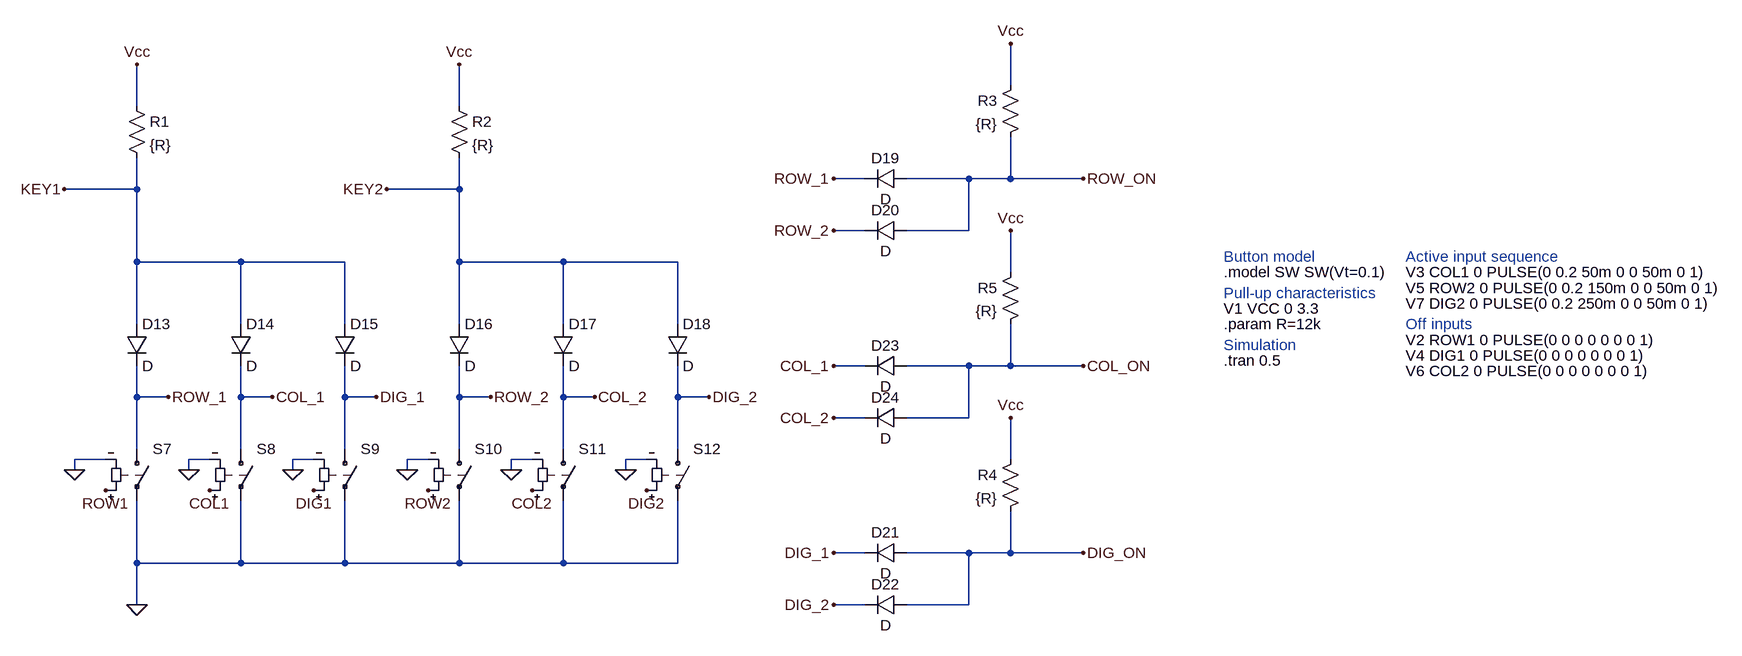
[diagram p0: schematic keyboard.asc]
keyboard.asc, the LTspice schematic file:
Version 4
SHEET 1 4832 1104
WIRE 3712 -48 3712 -112
WIRE 2368 -16 2368 -80
WIRE 2864 -16 2864 -80
WIRE 3488 96 3440 96
WIRE 3648 96 3552 96
WIRE 3712 96 3712 32
WIRE 3712 96 3648 96
WIRE 3824 96 3712 96
WIRE 2368 112 2368 64
WIRE 2368 112 2256 112
WIRE 2864 112 2864 64
WIRE 2864 112 2752 112
WIRE 3488 176 3440 176
WIRE 3648 176 3648 96
WIRE 3648 176 3552 176
WIRE 2368 224 2368 112
WIRE 2528 224 2368 224
WIRE 2688 224 2528 224
WIRE 2864 224 2864 112
WIRE 3024 224 2864 224
WIRE 3200 224 3024 224
WIRE 3712 240 3712 176
WIRE 2368 320 2368 224
WIRE 2528 320 2528 224
WIRE 2688 320 2688 224
WIRE 2864 320 2864 224
WIRE 3024 320 3024 224
WIRE 3200 320 3200 224
WIRE 3488 384 3440 384
WIRE 3648 384 3552 384
WIRE 3712 384 3712 320
WIRE 3712 384 3648 384
WIRE 3824 384 3712 384
WIRE 2368 432 2368 384
WIRE 2416 432 2368 432
WIRE 2528 432 2528 384
WIRE 2576 432 2528 432
WIRE 2688 432 2688 384
WIRE 2736 432 2688 432
WIRE 2864 432 2864 384
WIRE 2912 432 2864 432
WIRE 3024 432 3024 384
WIRE 3072 432 3024 432
WIRE 3200 432 3200 384
WIRE 3248 432 3200 432
WIRE 3488 464 3440 464
WIRE 3648 464 3648 384
WIRE 3648 464 3552 464
WIRE 2368 512 2368 432
WIRE 2528 512 2528 432
WIRE 2688 512 2688 432
WIRE 2864 512 2864 432
WIRE 3024 512 3024 432
WIRE 3200 512 3200 432
WIRE 2320 528 2272 528
WIRE 2480 528 2448 528
WIRE 2640 528 2608 528
WIRE 2816 528 2784 528
WIRE 2976 528 2944 528
WIRE 3152 528 3120 528
WIRE 3712 528 3712 464
WIRE 2272 544 2272 528
WIRE 2448 544 2448 528
WIRE 2608 544 2608 528
WIRE 2784 544 2784 528
WIRE 2944 544 2944 528
WIRE 3120 544 3120 528
WIRE 3488 672 3440 672
WIRE 3648 672 3552 672
WIRE 3712 672 3712 608
WIRE 3712 672 3648 672
WIRE 3824 672 3712 672
WIRE 2368 688 2368 592
WIRE 2528 688 2528 592
WIRE 2528 688 2368 688
WIRE 2688 688 2688 592
WIRE 2688 688 2528 688
WIRE 2864 688 2864 592
WIRE 2864 688 2688 688
WIRE 3024 688 3024 592
WIRE 3024 688 2864 688
WIRE 3200 688 3200 592
WIRE 3200 688 3024 688
WIRE 2368 752 2368 688
WIRE 3488 752 3440 752
WIRE 3648 752 3648 672
WIRE 3648 752 3552 752
FLAG 2368 -80 Vcc
FLAG 2256 112 KEY1
FLAG 2320 576 ROW1
FLAG 2480 576 COL1
FLAG 2640 576 DIG1
FLAG 2368 752 0
FLAG 2864 -80 Vcc
FLAG 2752 112 KEY2
FLAG 2816 576 ROW2
FLAG 2976 576 COL2
FLAG 3152 576 DIG2
FLAG 3712 -112 Vcc
FLAG 3824 96 ROW_ON
FLAG 3712 464 Vcc
FLAG 3824 672 DIG_ON
FLAG 3824 384 COL_ON
FLAG 3712 176 Vcc
FLAG 2784 544 0
FLAG 2944 544 0
FLAG 3120 544 0
FLAG 2608 544 0
FLAG 2448 544 0
FLAG 2272 544 0
FLAG 2416 432 ROW_1
FLAG 2576 432 COL_1
FLAG 2736 432 DIG_1
FLAG 2912 432 ROW_2
FLAG 3072 432 COL_2
FLAG 3248 432 DIG_2
FLAG 3440 96 ROW_1
FLAG 3440 176 ROW_2
FLAG 3440 384 COL_1
FLAG 3440 464 COL_2
FLAG 3440 752 DIG_2
FLAG 3440 672 DIG_1
SYMBOL res 2352 -32 R0
SYMATTR InstName R1
SYMATTR Value {R}
SYMBOL diode 2352 320 R0
SYMATTR InstName D13
SYMBOL diode 2512 320 R0
SYMATTR InstName D14
SYMBOL diode 2672 320 R0
SYMATTR InstName D15
SYMBOL sw 2368 496 R0
WINDOW 3 24 44 Left 2
SYMATTR Value ""
SYMATTR InstName S7
SYMATTR SpiceModel SW
SYMBOL sw 2528 496 R0
WINDOW 3 24 44 Left 2
SYMATTR Value ""
SYMATTR InstName S8
SYMATTR SpiceModel SW
SYMBOL sw 2688 496 R0
WINDOW 3 24 44 Left 2
SYMATTR Value ""
SYMATTR InstName S9
SYMATTR SpiceModel SW
SYMBOL res 2848 -32 R0
SYMATTR InstName R2
SYMATTR Value {R}
SYMBOL diode 2848 320 R0
SYMATTR InstName D16
SYMBOL diode 3008 320 R0
SYMATTR InstName D17
SYMBOL diode 3184 320 R0
SYMATTR InstName D18
SYMBOL sw 2864 496 R0
WINDOW 3 24 44 Left 2
SYMATTR Value ""
SYMATTR InstName S10
SYMATTR SpiceModel SW
SYMBOL sw 3024 496 R0
WINDOW 3 24 44 Left 2
SYMATTR Value ""
SYMATTR InstName S11
SYMATTR SpiceModel SW
SYMBOL sw 3200 496 R0
WINDOW 3 24 44 Left 2
SYMATTR Value ""
SYMATTR InstName S12
SYMATTR SpiceModel SW
SYMBOL res 3728 -64 M0
SYMATTR InstName R3
SYMATTR Value {R}
SYMBOL diode 3552 112 M270
WINDOW 0 32 32 VTop 2
WINDOW 3 0 32 VBottom 2
SYMATTR InstName D19
SYMBOL diode 3552 192 M270
WINDOW 0 32 32 VTop 2
WINDOW 3 0 32 VBottom 2
SYMATTR InstName D20
SYMBOL res 3728 512 M0
SYMATTR InstName R4
SYMATTR Value {R}
SYMBOL diode 3552 688 M270
WINDOW 0 32 32 VTop 2
WINDOW 3 0 32 VBottom 2
SYMATTR InstName D21
SYMBOL diode 3552 768 M270
WINDOW 0 32 32 VTop 2
WINDOW 3 0 32 VBottom 2
SYMATTR InstName D22
SYMBOL res 3728 224 M0
SYMATTR InstName R5
SYMATTR Value {R}
SYMBOL diode 3552 400 M270
WINDOW 0 32 32 VTop 2
WINDOW 3 0 32 VBottom 2
SYMATTR InstName D23
SYMBOL diode 3552 480 M270
WINDOW 0 32 32 VTop 2
WINDOW 3 0 32 VBottom 2
SYMATTR InstName D24
TEXT 4040 240 Left 2 !.model SW SW(Vt=0.1)
TEXT 4040 320 Left 2 !.param R=12k
TEXT 4040 376 Left 2 !.tran 0.5
TEXT 4320 344 Left 2 !V2 ROW1 0 PULSE(0 0 0 0 0 0 0 1)
TEXT 4040 296 Left 2 !V1 VCC 0 3.3
TEXT 4320 240 Left 2 !V3 COL1 0 PULSE(0 0.2 50m 0 0 50m 0 1)
TEXT 4320 368 Left 2 !V4 DIG1 0 PULSE(0 0 0 0 0 0 0 1)
TEXT 4320 264 Left 2 !V5 ROW2 0 PULSE(0 0.2 150m 0 0 50m 0 1)
TEXT 4320 392 Left 2 !V6 COL2 0 PULSE(0 0 0 0 0 0 0 1)
TEXT 4320 288 Left 2 !V7 DIG2 0 PULSE(0 0.2 250m 0 0 50m 0 1)
TEXT 4320 320 Left 2 ;Off inputs
TEXT 4320 216 Left 2 ;Active input sequence
TEXT 4040 272 Left 2 ;Pull-up characteristics
TEXT 4040 216 Left 2 ;Button model
TEXT 4040 352 Left 2 ;Simulation

The netlist it stands for:
* keyboard.asc
R1 Vcc KEY1 {R}
D13 KEY1 ROW_1 D
D14 KEY1 COL_1 D
D15 KEY1 DIG_1 D
S7 ROW_1 0 ROW1 0 SW
S8 COL_1 0 COL1 0 SW
S9 DIG_1 0 DIG1 0 SW
R2 Vcc KEY2 {R}
D16 KEY2 ROW_2 D
D17 KEY2 COL_2 D
D18 KEY2 DIG_2 D
S10 ROW_2 0 ROW2 0 SW
S11 COL_2 0 COL2 0 SW
S12 DIG_2 0 DIG2 0 SW
R3 Vcc ROW_ON {R}
D19 ROW_ON ROW_1 D
D20 ROW_ON ROW_2 D
R4 Vcc DIG_ON {R}
D21 DIG_ON DIG_1 D
D22 DIG_ON DIG_2 D
R5 Vcc COL_ON {R}
D23 COL_ON COL_1 D
D24 COL_ON COL_2 D
.model D D
.lib standard.dio
.model SW SW(Vt=0.1)
.param R=12k
.tran 0.5
V2 ROW1 0 PULSE(0 0 0 0 0 0 0 1)
V1 VCC 0 3.3
V3 COL1 0 PULSE(0 0.2 50m 0 0 50m 0 1)
V4 DIG1 0 PULSE(0 0 0 0 0 0 0 1)
V5 ROW2 0 PULSE(0 0.2 150m 0 0 50m 0 1)
V6 COL2 0 PULSE(0 0 0 0 0 0 0 1)
V7 DIG2 0 PULSE(0 0.2 250m 0 0 50m 0 1)
* Off inputs
* Active input sequence
* Pull-up characteristics
* Button model
* Simulation
.backanno
.end